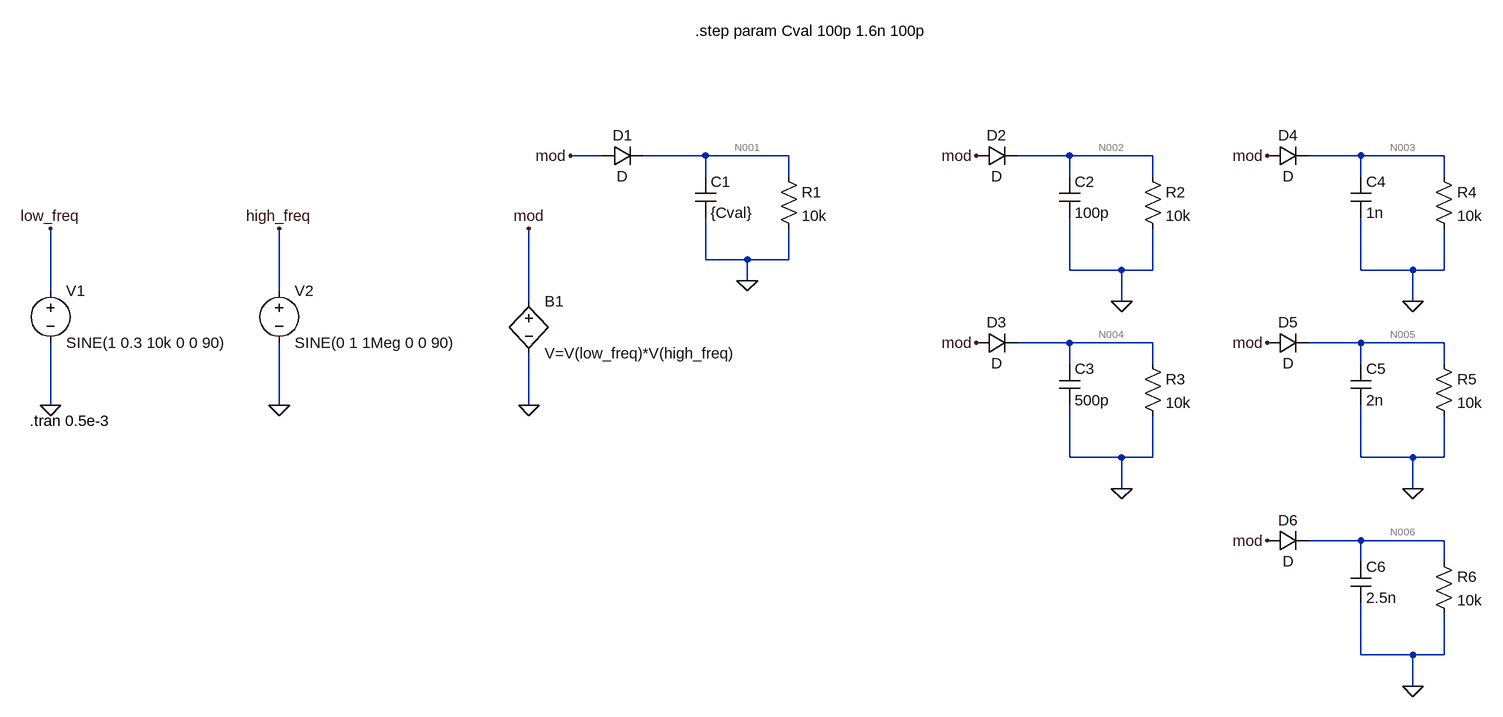
[diagram p0: schematic Mod_Generator.asc]
Mod_Generator.asc, the LTspice schematic file:
Version 4.1
SHEET 1 2116 756
WIRE 752 -80 704 -80
WIRE 912 -80 816 -80
WIRE 1040 -80 912 -80
WIRE 1472 -80 1392 -80
WIRE 1600 -80 1472 -80
WIRE 1920 -80 1840 -80
WIRE 2048 -80 1920 -80
WIRE 912 -48 912 -80
WIRE 1040 -48 1040 -80
WIRE 1472 -48 1472 -80
WIRE 1600 -48 1600 -80
WIRE 1920 -48 1920 -80
WIRE 2048 -48 2048 -80
WIRE 912 80 912 16
WIRE 976 80 912 80
WIRE 1040 80 1040 32
WIRE 1040 80 976 80
WIRE 1472 96 1472 16
WIRE 1552 96 1472 96
WIRE 1600 96 1600 32
WIRE 1600 96 1552 96
WIRE 1920 96 1920 16
WIRE 2000 96 1920 96
WIRE 2048 96 2048 32
WIRE 2048 96 2000 96
WIRE 976 112 976 80
WIRE -96 128 -96 32
WIRE 256 128 256 32
WIRE 640 144 640 32
WIRE 1552 144 1552 96
WIRE 2000 144 2000 96
WIRE 1472 208 1392 208
WIRE 1600 208 1472 208
WIRE 1920 208 1840 208
WIRE 2048 208 1920 208
WIRE 1472 240 1472 208
WIRE 1600 240 1600 208
WIRE 1920 240 1920 208
WIRE 2048 240 2048 208
WIRE -96 304 -96 208
WIRE 256 304 256 208
WIRE 640 304 640 224
WIRE 1472 384 1472 304
WIRE 1552 384 1472 384
WIRE 1600 384 1600 320
WIRE 1600 384 1552 384
WIRE 1920 384 1920 304
WIRE 2000 384 1920 384
WIRE 2048 384 2048 320
WIRE 2048 384 2000 384
WIRE 1552 432 1552 384
WIRE 2000 432 2000 384
WIRE 1920 512 1840 512
WIRE 2048 512 1920 512
WIRE 1920 544 1920 512
WIRE 2048 544 2048 512
WIRE 1920 688 1920 608
WIRE 2000 688 1920 688
WIRE 2048 688 2048 624
WIRE 2048 688 2000 688
WIRE 2000 736 2000 688
FLAG -96 304 0
FLAG 256 304 0
FLAG -96 32 low_freq
FLAG 256 32 high_freq
FLAG 640 304 0
FLAG 640 32 mod
FLAG 976 112 0
FLAG 704 -80 mod
FLAG 1328 -80 mod
FLAG 1552 144 0
FLAG 1328 208 mod
FLAG 1552 432 0
FLAG 1776 -80 mod
FLAG 2000 144 0
FLAG 1776 208 mod
FLAG 2000 432 0
FLAG 1776 512 mod
FLAG 2000 736 0
SYMBOL voltage -96 112 R0
WINDOW 123 0 0 Left 0
WINDOW 39 0 0 Left 0
SYMATTR InstName V1
SYMATTR Value SINE(1 0.3 10k 0 0 90)
SYMBOL voltage 256 112 R0
WINDOW 123 0 0 Left 0
WINDOW 39 0 0 Left 0
SYMATTR InstName V2
SYMATTR Value SINE(0 1 1Meg 0 0 90)
SYMBOL bv 640 128 R0
SYMATTR InstName B1
SYMATTR Value V=V(low_freq)*V(high_freq)
SYMBOL diode 752 -64 R270
WINDOW 0 32 32 VTop 2
WINDOW 3 0 32 VBottom 2
SYMATTR InstName D1
SYMBOL cap 896 -48 R0
SYMATTR InstName C1
SYMATTR Value {Cval}
SYMBOL res 1024 -64 R0
SYMATTR InstName R1
SYMATTR Value 10k
SYMBOL diode 1328 -64 R270
WINDOW 0 32 32 VTop 2
WINDOW 3 0 32 VBottom 2
SYMATTR InstName D2
SYMBOL cap 1456 -48 R0
SYMATTR InstName C2
SYMATTR Value 100p
SYMBOL res 1584 -64 R0
SYMATTR InstName R2
SYMATTR Value 10k
SYMBOL diode 1328 224 R270
WINDOW 0 32 32 VTop 2
WINDOW 3 0 32 VBottom 2
SYMATTR InstName D3
SYMBOL cap 1456 240 R0
SYMATTR InstName C3
SYMATTR Value 500p
SYMBOL res 1584 224 R0
SYMATTR InstName R3
SYMATTR Value 10k
SYMBOL diode 1776 -64 R270
WINDOW 0 32 32 VTop 2
WINDOW 3 0 32 VBottom 2
SYMATTR InstName D4
SYMBOL cap 1904 -48 R0
SYMATTR InstName C4
SYMATTR Value 1n
SYMBOL res 2032 -64 R0
SYMATTR InstName R4
SYMATTR Value 10k
SYMBOL diode 1776 224 R270
WINDOW 0 32 32 VTop 2
WINDOW 3 0 32 VBottom 2
SYMATTR InstName D5
SYMBOL cap 1904 240 R0
SYMATTR InstName C5
SYMATTR Value 2n
SYMBOL res 2032 224 R0
SYMATTR InstName R5
SYMATTR Value 10k
SYMBOL diode 1776 528 R270
WINDOW 0 32 32 VTop 2
WINDOW 3 0 32 VBottom 2
SYMATTR InstName D6
SYMBOL cap 1904 544 R0
SYMATTR InstName C6
SYMATTR Value 2.5n
SYMBOL res 2032 528 R0
SYMATTR InstName R6
SYMATTR Value 10k
TEXT -128 328 Left 2 !.tran 0.5e-3
TEXT 896 -272 Left 2 !.step param Cval 100p 1.6n 100p

The netlist it stands for:
* Mod_Generator.asc
V1 low_freq 0 SINE(1 0.3 10k 0 0 90)
V2 high_freq 0 SINE(0 1 1Meg 0 0 90)
B1 mod 0 V=V(low_freq)*V(high_freq)
D1 mod N001 D
C1 N001 0 {Cval}
R1 N001 0 10k
D2 mod N002 D
C2 N002 0 100p
R2 N002 0 10k
D3 mod N004 D
C3 N004 0 500p
R3 N004 0 10k
D4 mod N003 D
C4 N003 0 1n
R4 N003 0 10k
D5 mod N005 D
C5 N005 0 2n
R5 N005 0 10k
D6 mod N006 D
C6 N006 0 2.5n
R6 N006 0 10k
.model D D
.lib standard.dio
.tran 0.5e-3
.step param Cval 100p 1.6n 100p
.backanno
.end

* Results of the author's LTspice run, read from the files saved beside the schematic
* Operating Point (first step), zero values left out:
*   V(high_freq) = 1 V
*   V(n001) = 713.2 mV
*   V(n002) = 713.2 mV
*   V(n003) = 713.2 mV
*   V(low_freq) = 1.3 V
*   V(mod) = 1.3 V
*   V(n004) = 713.2 mV
*   V(n005) = 713.2 mV
*   V(n006) = 713.2 mV
*   I(B1) = -427.9 µA
*   I(D4) = 71.32 µA
*   I(R6) = 71.32 µA
*   I(R1) = 71.32 µA
*   I(D5) = 71.32 µA
*   I(D6) = 71.32 µA
*   I(R2) = 71.32 µA
*   I(D3) = 71.32 µA
*   I(R3) = 71.32 µA
*   I(R4) = 71.32 µA
*   I(R5) = 71.32 µA
*   I(D1) = 71.32 µA
*   I(D2) = 71.32 µA